# EAGLE design VideoAudio (EAGLE 8.0.0)
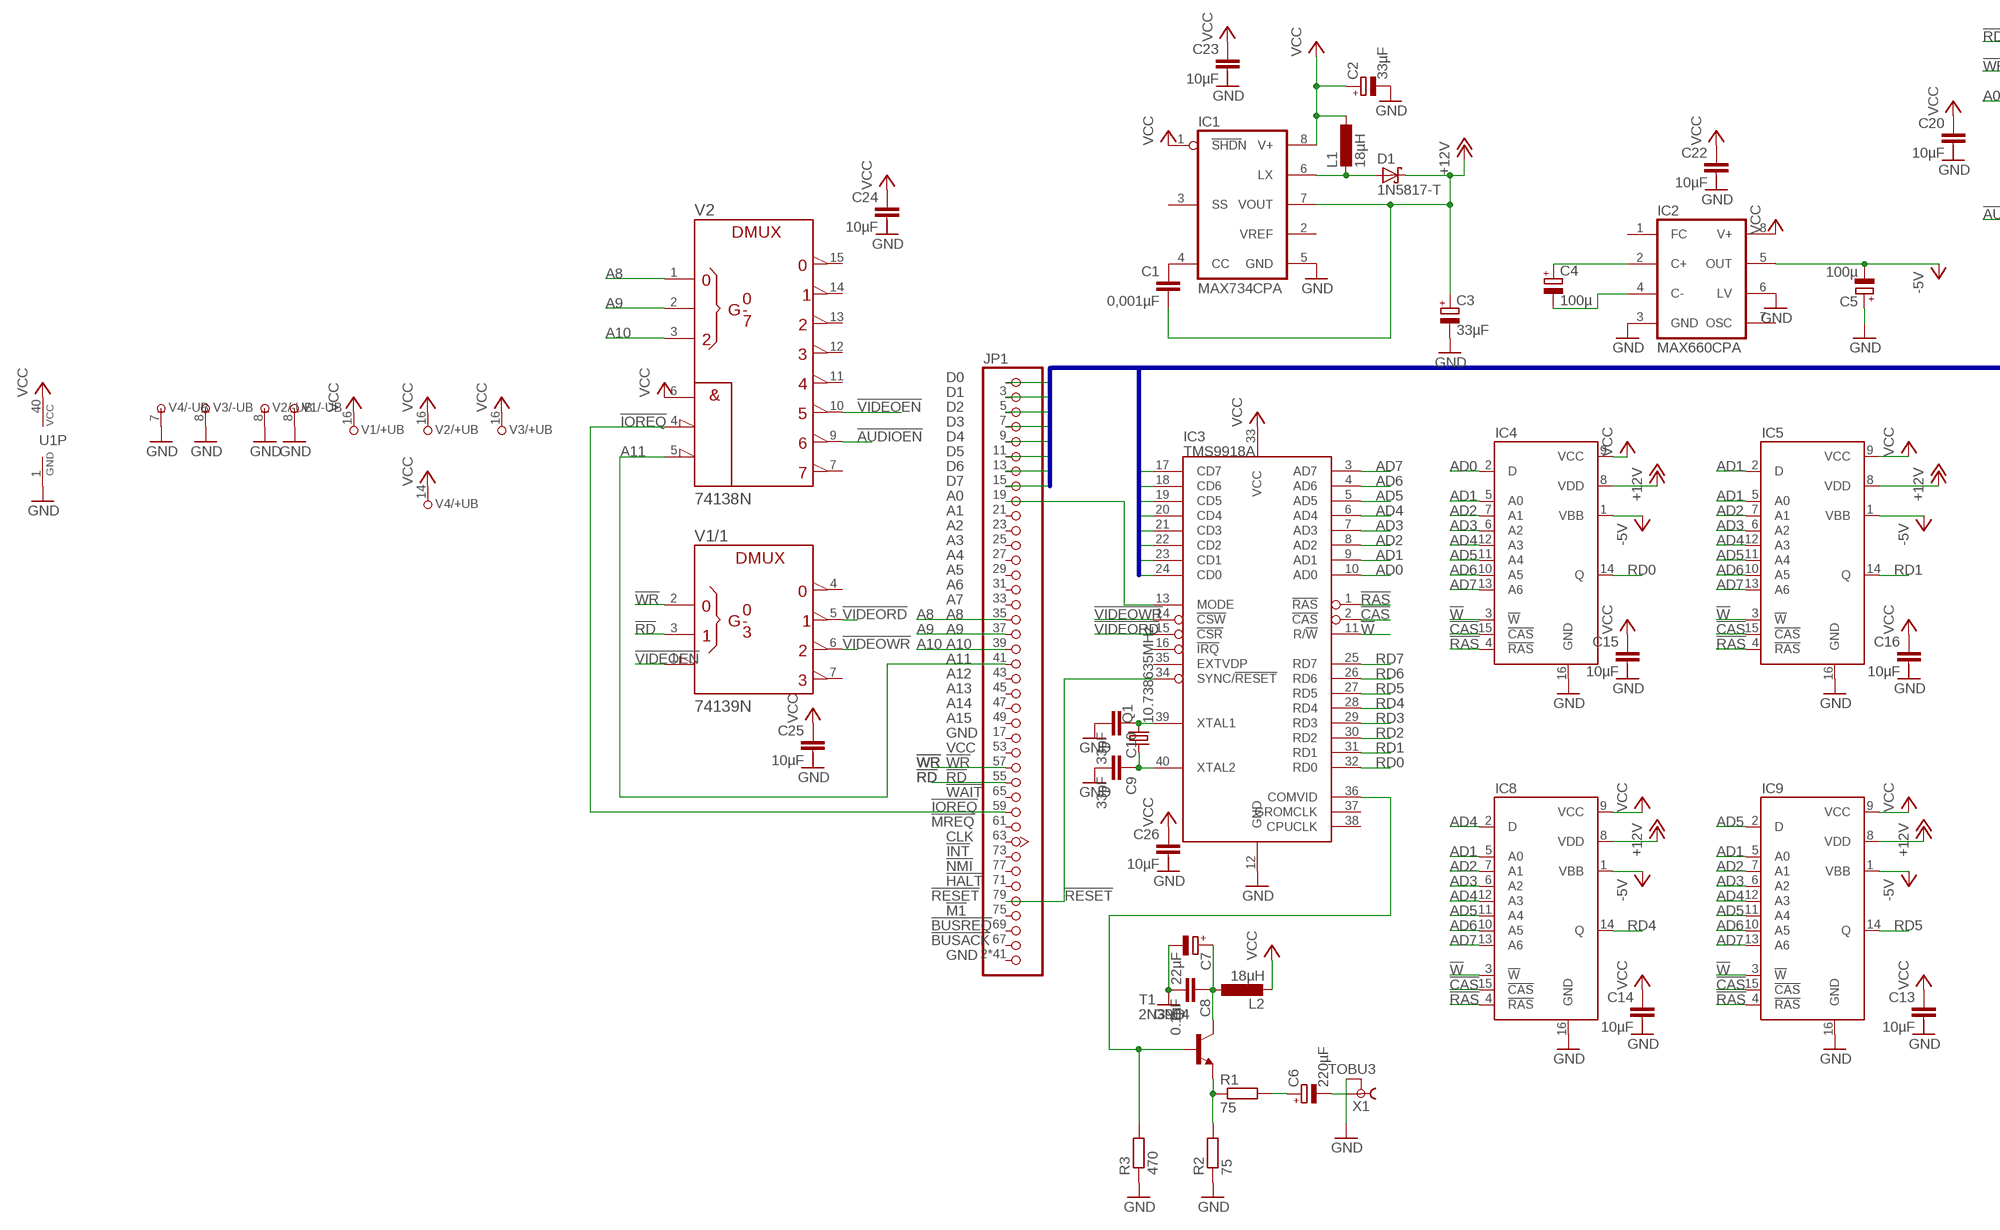
[diagram p0: schematic, sheet 1, part 1 of 2]
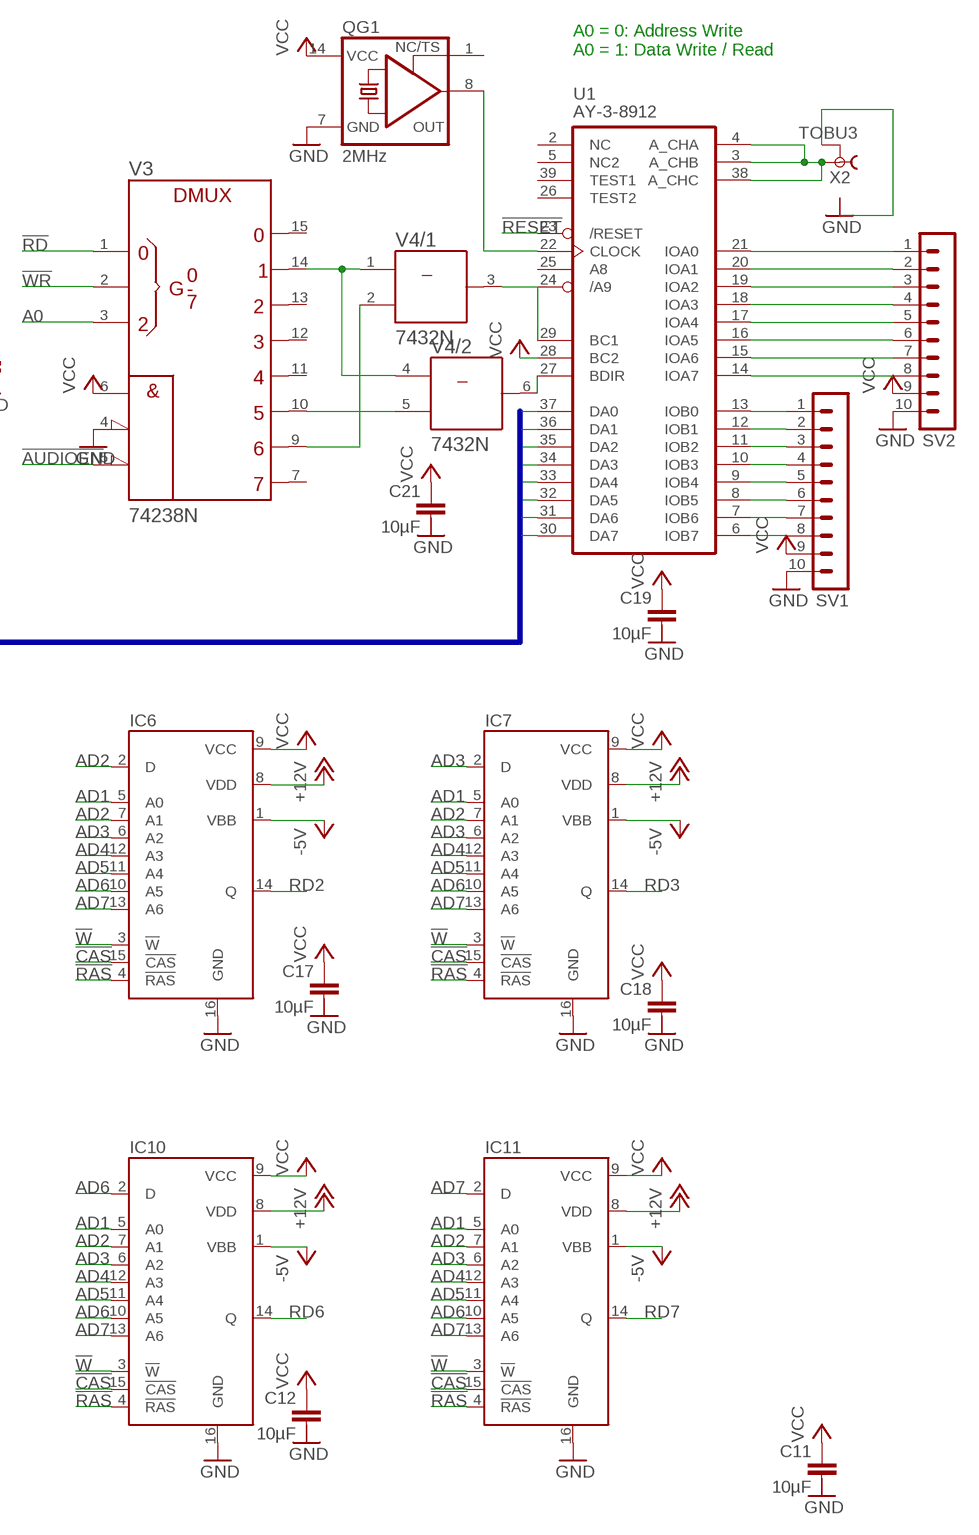
[diagram p1: schematic, sheet 1, part 2 of 2]

## Parts
C1  0,001µF  C-EU050-025X075  [C050-025X075]
C2  33µF  CPOL-EUE2.5-5  [E2,5-5]
C3  33µF  CPOL-EUE2.5-5  [E2,5-5]
C4  100µ  CPOL-EUE2.5-6  [E2,5-6]
C5  100µ  CPOL-EUE2.5-6  [E2,5-6]
C6  220µF  CPOL-EUE2.5-5  [E2,5-5]
C7  22µF  CPOL-EUE2.5-5  [E2,5-5]
C8  0.1µF  C-EU025-030X050  [C025-030X050]
C9  33pF  C-EU025-030X050  [C025-030X050]
C10  33pF  C-EU025-030X050  [C025-030X050]
C11  10µF  C-EU050-025X075  [C050-025X075]
C12  10µF  C-EU050-025X075  [C050-025X075]
C13  10µF  C-EU050-025X075  [C050-025X075]
C14  10µF  C-EU050-025X075  [C050-025X075]
C15  10µF  C-EU050-025X075  [C050-025X075]
C16  10µF  C-EU050-025X075  [C050-025X075]
C17  10µF  C-EU050-025X075  [C050-025X075]
C18  10µF  C-EU050-025X075  [C050-025X075]
C19  10µF  C-EU050-025X075  [C050-025X075]
C20  10µF  C-EU050-025X075  [C050-025X075]
C21  10µF  C-EU050-025X075  [C050-025X075]
C22  10µF  C-EU050-025X075  [C050-025X075]
C23  10µF  C-EU050-025X075  [C050-025X075]
C24  10µF  C-EU050-025X075  [C050-025X075]
C25  10µF  C-EU050-025X075  [C050-025X075]
C26  10µF  C-EU050-025X075  [C050-025X075]
D1  1N5817-T  [DO41-7.6]
IC1  MAX734CPA  [DIL08]
IC2  MAX660CPA  [DIL08]
IC3  TMS9918A  [DIP40]
IC4  TMS4116  [DIL16]
IC5  TMS4116  [DIL16]
IC6  TMS4116  [DIL16]
IC7  TMS4116  [DIL16]
IC8  TMS4116  [DIL16]
IC9  TMS4116  [DIL16]
IC10  TMS4116  [DIL16]
IC11  TMS4116  [DIL16]
JP1  JEANNECTOR/90  [2X25/90]
L1  18µH  L-EU0204/7  [0204/7]
L2  18µH  L-EU0204/7  [0204/7]
Q1  10.738635MHz  CRYSTALHC49U70  [HC49U70]
QG1  2MHz  XO-14  [DIL14S]
R1  75  R-EU_0204/2V  [0204V]
R2  75  R-EU_0204/2V  [0204V]
R3  470  R-EU_0204/2V  [0204V]
SV1  MA10-1  [MA10-1]
SV2  MA10-1  [MA10-1]
T1  2N3904  [TO92]
U1  AY-3-8912  [DIL40]
V1  74139N  [DIL16]
V2  74138N  [DIL16]
V3  74238N  [DIL16]
V4  7432N  [DIL14]
X1  TOBU3  [TOBU3]
X2  TOBU3  [TOBU3]

## Nets
!AUDIOEN: V2.9(Y6) V3.5(!G2B)
!CAS: IC3.2(!CAS) IC4.15(!CAS) IC5.15(!CAS) IC6.15(!CAS) IC7.15(!CAS) IC8.15(!CAS) IC9.15(!CAS) IC10.15(!CAS) IC11.15(!CAS)
!IOREQ: JP1.59(!IOREQ) V2.4(!G2A)
!RAS: IC3.1(!RAS) IC4.4(!RAS) IC5.4(!RAS) IC6.4(!RAS) IC7.4(!RAS) IC8.4(!RAS) IC9.4(!RAS) IC10.4(!RAS) IC11.4(!RAS)
!RD: JP1.55(!RD) V1.3(/1:B) V3.1(A)
!RESET: IC3.34(SYNC/!RESET) JP1.79(!RESET) U1.23(/RESET)
!VIDEOEN: V1.1(/1:!G) V2.10(Y5)
!VIDEORD: IC3.15(!CSR) V1.5(/1:Y1)
!VIDEOWR: IC3.14(!CSW) V1.6(/1:Y2)
!W: IC3.11(R/!W) IC4.3(!W) IC5.3(!W) IC6.3(!W) IC7.3(!W) IC8.3(!W) IC9.3(!W) IC10.3(!W) IC11.3(!W)
!WR: JP1.57(!WR) V1.2(/1:A) V3.2(B)
+12V: C1.2 C3.+ D1.C IC1.7(VOUT) IC4.8(VDD) IC5.8(VDD) IC6.8(VDD) IC7.8(VDD) IC8.8(VDD) IC9.8(VDD) IC10.8(VDD) IC11.8(VDD)
-5V: C5.- IC2.5(OUT) IC4.1(VBB) IC5.1(VBB) IC6.1(VBB) IC7.1(VBB) IC8.1(VBB) IC9.1(VBB) IC10.1(VBB) IC11.1(VBB)
A0: V3.3(C)
A8: JP1.35(A8) V2.1(A)
A9: JP1.37(A9) V2.2(B)
A10: JP1.39(A10) V2.3(C)
A11: JP1.41(A11) V2.5(!G2B)
AD0: IC3.10(AD0) IC4.2(D)
AD1: IC3.9(AD1) IC4.5(A0) IC5.2(D) IC5.5(A0) IC6.5(A0) IC7.5(A0) IC8.5(A0) IC9.5(A0) IC10.5(A0) IC11.5(A0)
AD2: IC3.8(AD2) IC4.7(A1) IC5.7(A1) IC6.2(D) IC6.7(A1) IC7.7(A1) IC8.7(A1) IC9.7(A1) IC10.7(A1) IC11.7(A1)
AD3: IC3.7(AD3) IC4.6(A2) IC5.6(A2) IC6.6(A2) IC7.2(D) IC7.6(A2) IC8.6(A2) IC9.6(A2) IC10.6(A2) IC11.6(A2)
AD4: IC3.6(AD4) IC4.12(A3) IC5.12(A3) IC6.12(A3) IC7.12(A3) IC8.2(D) IC8.12(A3) IC9.12(A3) IC10.12(A3) IC11.12(A3)
AD5: IC3.5(AD5) IC4.11(A4) IC5.11(A4) IC6.11(A4) IC7.11(A4) IC8.11(A4) IC9.2(D) IC9.11(A4) IC10.11(A4) IC11.11(A4)
AD6: IC3.4(AD6) IC4.10(A5) IC5.10(A5) IC6.10(A5) IC7.10(A5) IC8.10(A5) IC9.10(A5) IC10.2(D) IC10.10(A5) IC11.10(A5)
AD7: IC3.3(AD7) IC4.13(A6) IC5.13(A6) IC6.13(A6) IC7.13(A6) IC8.13(A6) IC9.13(A6) IC10.13(A6) IC11.2(D) IC11.13(A6)
D0: IC3.24(CD0) JP1.1(D0) U1.37(DA0)
D1: IC3.23(CD1) JP1.3(D1) U1.36(DA1)
D2: IC3.22(CD2) JP1.5(D2) U1.35(DA2)
D3: IC3.21(CD3) JP1.7(D3) U1.34(DA3)
D4: IC3.20(CD4) JP1.9(D4) U1.33(DA4)
D5: IC3.19(CD5) JP1.11(D5) U1.32(DA5)
D6: IC3.18(CD6) JP1.13(D6) U1.31(DA6)
D7: IC3.17(CD7) JP1.15(D7) U1.30(DA7)
GND: C2.- C3.- C5.+ C7.- C8.2 C9.2 C10.2 IC1.5(GND) IC2.3(GND) IC2.6(LV) IC3.12(GND) IC4.16(GND) IC5.16(GND) IC6.16(GND) IC7.16(GND) IC8.16(GND) IC9.16(GND) IC10.16(GND) IC11.16(GND) QG1.7(GND) R2.1 R3.1 SV1.10 SV2.10 U1.1(GND) V1.8(/-UB:-UB) V2.8(-UB) V3.4(!G2A) V3.8(-UB) V4.7(/-UB:-UB) X1.2 X1.2@1 X1.2@2 X2.2 X2.2@1 X2.2@2
N$1: C4.- IC2.4(C-)
N$2: C4.+ IC2.2(C+)
N$3: D1.A IC1.6(LX) L1.2
N$4: C1.1 IC1.4(CC)
N$5: IC3.13(MODE) JP1.19(A0)
N$6: U1.3(A_CHB) U1.4(A_CHA) U1.38(A_CHC) X2.1
N$7: C6.- X1.1
N$8: C6.+ R1.2
N$9: R1.1 R2.2 T1.3(E)
N$10: IC3.36(COMVID) R3.2 T1.2(B)
N$11: V3.9(Y6) V4.2(/1:B)
N$12: C7.+ C8.1 L2.1 T1.1(C)
N$13: C10.1 IC3.39(XTAL1) Q1.2
N$14: C9.1 IC3.40(XTAL2) Q1.1
N$15: U1.29(BC1) V4.3(/1:Y)
N$16: V3.14(Y1) V4.1(/1:A) V4.4(/2:A)
N$17: U1.27(BDIR) V4.6(/2:Y)
N$18: V3.10(Y5) V4.5(/2:B)
N$19: SV1.1 U1.13(IOB0)
N$20: SV1.2 U1.12(IOB1)
N$21: SV1.3 U1.11(IOB2)
N$22: SV1.4 U1.10(IOB3)
N$23: SV1.5 U1.9(IOB4)
N$24: SV1.6 U1.8(IOB5)
N$25: SV1.7 U1.7(IOB6)
N$26: SV1.8 U1.6(IOB7)
N$27: QG1.8(OUT) U1.22(CLOCK)
N$28: SV2.1 U1.21(IOA0)
N$29: SV2.2 U1.20(IOA1)
N$30: SV2.3 U1.19(IOA2)
N$31: SV2.4 U1.18(IOA3)
N$32: SV2.5 U1.17(IOA4)
N$33: SV2.6 U1.16(IOA5)
N$34: SV2.7 U1.15(IOA6)
N$35: SV2.8 U1.14(IOA7)
RD0: IC3.32(RD0) IC4.14(Q)
RD1: IC3.31(RD1) IC5.14(Q)
RD2: IC3.30(RD2) IC6.14(Q)
RD3: IC3.29(RD3) IC7.14(Q)
RD4: IC3.28(RD4) IC8.14(Q)
RD5: IC3.27(RD5) IC9.14(Q)
RD6: IC3.26(RD6) IC10.14(Q)
RD7: IC3.25(RD7) IC11.14(Q)
VCC: C2.+ C11.1 C12.1 C13.1 C14.1 C15.1 C16.1 C17.1 C18.1 C19.1 C20.1 C21.1 C22.1 C23.1 C24.1 C25.1 C26.1 IC1.1(SHDN) IC1.8(V+) IC2.8(V+) IC3.33(VCC) IC4.9(VCC) IC5.9(VCC) IC6.9(VCC) IC7.9(VCC) IC8.9(VCC) IC9.9(VCC) IC10.9(VCC) IC11.9(VCC) L1.1 L2.2 QG1.14(VCC) SV1.9 SV2.9 U1.28(BC2) U1.40(VCC) V1.16(/+UB:+UB) V2.6(G1) V2.16(+UB) V3.6(G1) V3.16(+UB) V4.14(/+UB:+UB)
Unconnected: C11.2 C12.2 C13.2 C14.2 C15.2 C16.2 C17.2 C18.2 C19.2 C20.2 C21.2 C22.2 C23.2 C24.2 C25.2 C26.2 IC1.2(VREF) IC1.3(SS) IC2.1(FC) IC2.7(OSC) IC3.16(!IRQ) IC3.35(EXTVDP) IC3.37(GROMCLK) IC3.38(CPUCLK) JP1.21(A1) JP1.23(A2) JP1.25(A3) JP1.27(A4) JP1.29(A5) JP1.31(A6) JP1.33(A7) JP1.43(A12) JP1.45(A13) JP1.47(A14) JP1.49(A15) JP1.61(!MREQ) JP1.63(CLK) JP1.65(!WAIT) JP1.67(!BUSACK) JP1.69(!BUSRQ) JP1.71(!HALT) JP1.73(!INT) JP1.75(!M1) JP1.77(!NMI) QG1.1(TS) U1.2(NC) U1.5(NC2) U1.24(/A9) U1.25(A8) U1.26(TEST2) U1.39(TEST1) V1.4(/1:Y0) V1.7(/1:Y3) V1.9(/2:Y3) V1.10(/2:Y2) V1.11(/2:Y1) V1.12(/2:Y0) V1.13(/2:B) V1.14(/2:A) V1.15(/2:!G) V2.7(Y7) V2.11(Y4) V2.12(Y3) V2.13(Y2) V2.14(Y1) V2.15(Y0) V3.7(Y7) V3.11(Y4) V3.12(Y3) V3.13(Y2) V3.15(Y0) V4.8(/3:Y) V4.9(/3:A) V4.10(/3:B) V4.11(/4:Y) V4.12(/4:A) V4.13(/4:B)

## Buses
D[0..7]

## Notes on the sheet
- A0 = 0: Address Write
  A0 = 1: Data Write / Read

## Power pins joined to a net without a drawn wire
GND: JP1.2(GND) JP1.4(GND) JP1.6(GND) JP1.8(GND) JP1.10(GND) JP1.12(GND) JP1.14(GND) JP1.16(GND) JP1.17(GND) JP1.18(GND) JP1.20(GND) JP1.22(GND) JP1.24(GND) JP1.26(GND) JP1.28(GND) JP1.30(GND) JP1.32(GND) JP1.34(GND) JP1.36(GND) JP1.38(GND) JP1.40(GND) JP1.42(GND) JP1.44(GND) JP1.46(GND) JP1.48(GND) JP1.50(GND) JP1.51(GND) JP1.52(GND) JP1.54(GND) JP1.56(GND) JP1.58(GND) JP1.60(GND) JP1.62(GND) JP1.64(GND) JP1.66(GND) JP1.68(GND) JP1.70(GND) JP1.72(GND) JP1.74(GND) JP1.76(GND) JP1.78(GND) JP1.80(GND)
VCC: JP1.53(VCC)

## Library data of the parts
C1 C8-C26 = rcl:C-EU: CAPACITOR, European symbol
C2-C7 = rcl:CPOL-EU: POLARIZED CAPACITOR, European symbol
D1 = diode:1N581*: 1.0A SCHOTTKY BARRIER RECTIFIER Source: http://www.diodes.com/datasheets/ds23001.pdf
IC1 = jean:MAX734CPA: DC/DC CONVERTER; OC_FARNELL: unknown; OC_NEWARK: unknown
IC2 = maxim:MAX660CPA: Charge-pump VOLTAGE CONVERTER; MF: MAXIM; MPN: MAX660CPA; OC_FARNELL: 1187928; OC_NEWARK: 34C3964
IC3 = jean:TMS9918A
IC4-IC11 = jean:TMS4116: Dual In Line / Socket
JP1 = jean:JEANNECTOR: PIN HEADER
L1 L2 = rcl:L-EU: INDUCTOR, European symbol
Q1 = crystal:CRYSTAL: CRYSTAL; OC_FARNELL: unknown; OC_NEWARK: unknown
QG1 = crystal:XO-: CRYSTAL; OC_FARNELL: unknown; OC_NEWARK: unknown
R1-R3 = resistor:R-EU_: RESISTOR, European symbol
SV1 SV2 = con-lstb:MA10-1: PIN HEADER; OC_FARNELL: unknown; OC_NEWARK: unknown
T1 = transistor:2N3904: NPN TRANSISTOR
U1 = oldchips:AY-3-8912: Programmable sound generator
V1 = 74ttl-din:74*139: Dual 2-line to 4-line DECODER/DEMULTIPLEXER
V2 = 74ttl-din:74*138: 3-line to 8-line DECODER/DEMULTIPLEXER
V3 = 74ttl-din:74*238: 1 of 8 noninverting DECODER/DEMULTIPLEXER
V4 = 74ttl-din:74*32: Quad 2-input OR gate
X1 X2 = con-hirschmann:TOBU3: Female Cinch CONNECTOR ( RCA Jack ); MF: FARNELL; MPN: TOBU 3; OC_FARNELL: 592791; OC_NEWARK: 06WX5914

## Board
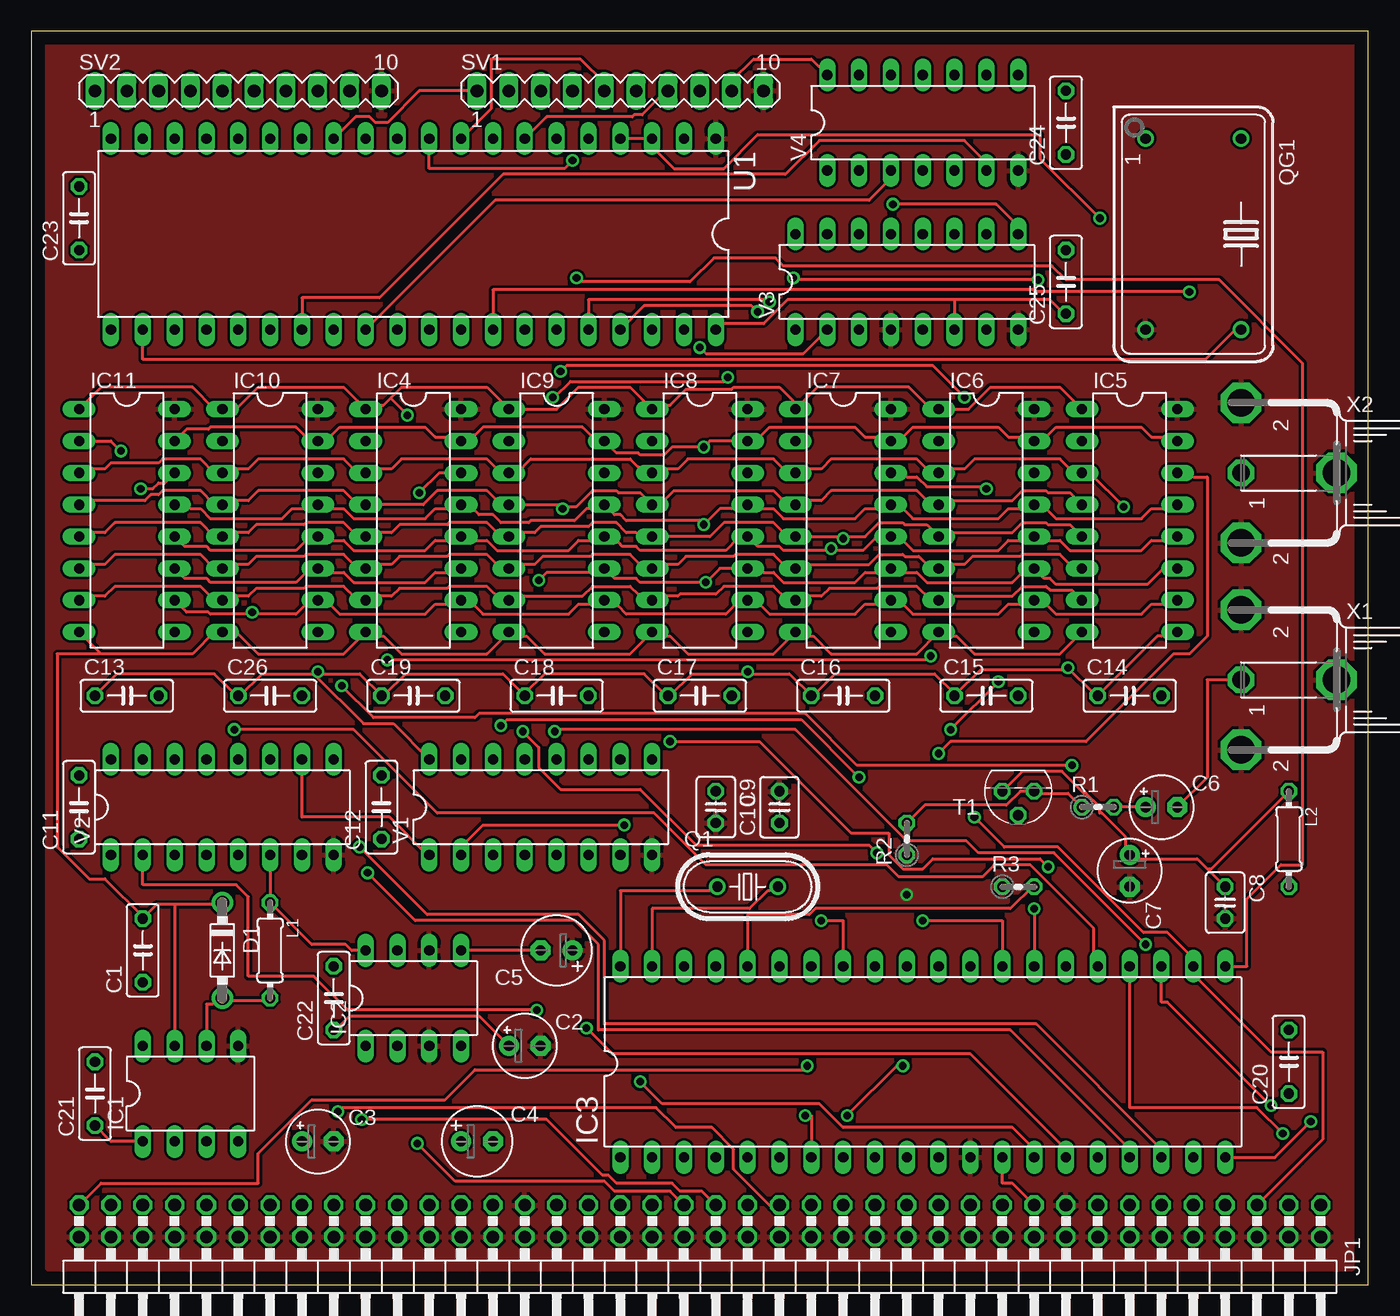
[diagram p2: board, top side]
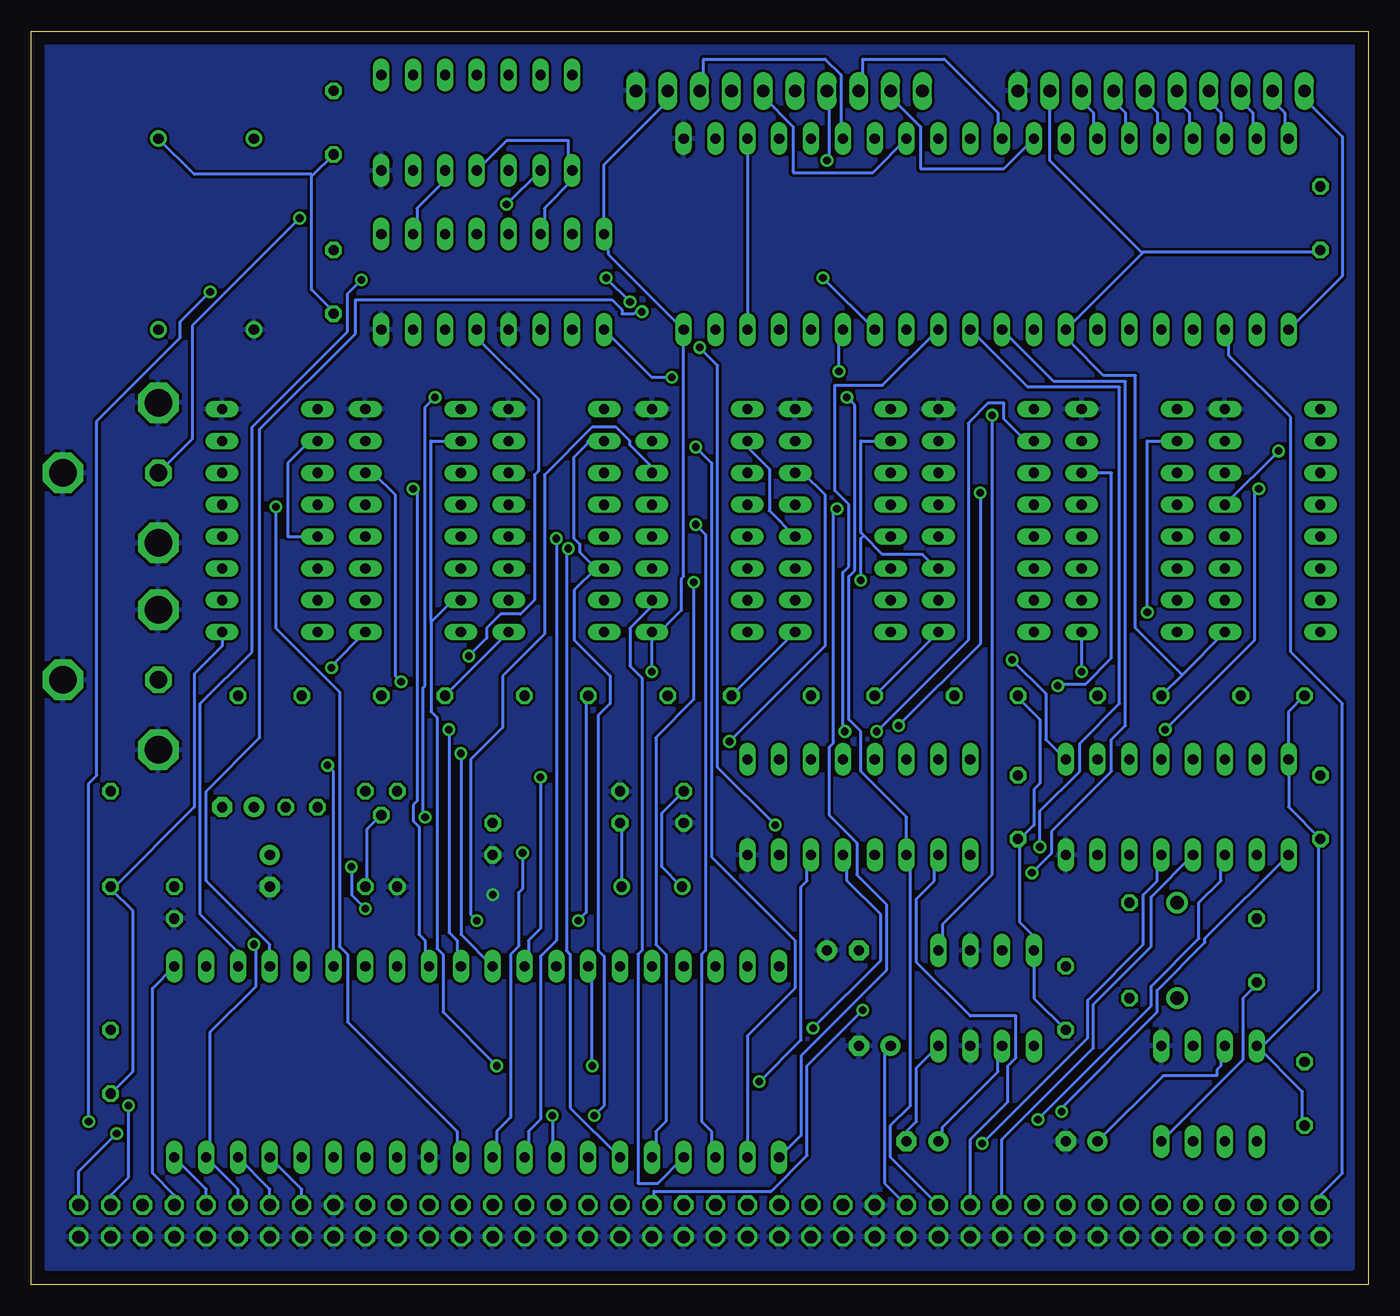
[diagram p3: board, bottom side, seen from below]

Size 106.66 x 100 mm. Coordinates in mm from the lower left corner, seen from the top.
Outline: 0,0 106.66,0 106.66,100 0,100 0,0
Copper layers (1*16): Top 0.035mm / dielectric 1.5mm / Bottom 0.035mm
Design rules "default": minimum track width 10mil, minimum drill 24mil, track to track 8mil, track to pad 8mil, pad to pad 8mil, via to via 8mil, smd to smd 8mil, copper to edge 40mil, drill to drill 8mil, minimum pad ring 10mil, minimum via ring 8mil, stop-mask expansion 4mil, vias tented up to drill 0mil, thermal gap 10mil

### Footprints (pad centres in the part's own frame; a part is rotated, then mirrored left to right if it is on the bottom)
C050-025X075 = drill 0.813 octagon: 1 -2.54,0; 2 2.54,0
E2,5-5 = drill 0.813 pad 1.6: + -1.27,0 | drill 0.813 pad 1.6 octagon: - 1.27,0
E2,5-6 = drill 0.813 pad 1.6: + -1.27,0 | drill 0.813 pad 1.6 octagon: - 1.27,0
C025-030X050 = drill 0.813 octagon: 1 -1.27,0; 2 1.27,0
DO41-7.6 = drill 1.1 pad 1.7: A 3.81,0; C -3.81,0
DIL08 = drill 0.813 long: 1 -3.81,-3.81; 2 -1.27,-3.81; 3 1.27,-3.81; 4 3.81,-3.81; 5 3.81,3.81; 6 1.27,3.81; 7 -1.27,3.81; 8 -3.81,3.81
DIP40 = drill 0.813 long: 1 -22.86,-7.62; 2 -20.32,-7.62; 3 -17.78,-7.62; 4 -15.24,-7.62; 5 -12.7,-7.62; 6 -10.16,-7.62; 7 -7.62,-7.62; 8 -5.08,-7.62; 9 -2.54,-7.62; 10 0,-7.62; 11 2.54,-7.62; 12 5.08,-7.62; 13 7.62,-7.62; 14 10.16,-7.62; 15 12.7,-7.62; 16 15.24,-7.62; 17 17.78,-7.62; 18 20.32,-7.62; 19 22.86,-7.62; 20 25.4,-7.62; 21 25.4,7.62; 22 22.86,7.62; 23 20.32,7.62; 24 17.78,7.62; 25 15.24,7.62; 26 12.7,7.62; 27 10.16,7.62; 28 7.62,7.62; 29 5.08,7.62; 30 2.54,7.62; 31 0,7.62; 32 -2.54,7.62; 33 -5.08,7.62; 34 -7.62,7.62; 35 -10.16,7.62; 36 -12.7,7.62; 37 -15.24,7.62; 38 -17.78,7.62; 39 -20.32,7.62; 40 -22.86,7.62
DIL16 = drill 0.813 long: 1 -8.89,-3.81; 2 -6.35,-3.81; 3 -3.81,-3.81; 4 -1.27,-3.81; 5 1.27,-3.81; 6 3.81,-3.81; 7 6.35,-3.81; 8 8.89,-3.81; 9 8.89,3.81; 10 6.35,3.81; 11 3.81,3.81; 12 1.27,3.81; 13 -1.27,3.81; 14 -3.81,3.81; 15 -6.35,3.81; 16 -8.89,3.81
2X25/90 = drill 1.016 octagon: 1 -29.21,-6.35; 2 -29.21,-3.81; 3 -26.67,-6.35; 4 -26.67,-3.81; 5 -24.13,-6.35; 6 -24.13,-3.81; 7 -21.59,-6.35; 8 -21.59,-3.81; 9 -19.05,-6.35; 10 -19.05,-3.81; 11 -16.51,-6.35; 12 -16.51,-3.81; 13 -13.97,-6.35; 14 -13.97,-3.81; 15 -11.43,-6.35; 16 -11.43,-3.81; 17 -8.89,-6.35; 18 -8.89,-3.81; 19 -6.35,-6.35; 20 -6.35,-3.81; 21 -3.81,-6.35; 22 -3.81,-3.81; 23 -1.27,-6.35; 24 -1.27,-3.81; 25 1.27,-6.35; 26 1.27,-3.81; 27 3.81,-6.35; 28 3.81,-3.81; 29 6.35,-6.35; 30 6.35,-3.81; 31 8.89,-6.35; 32 8.89,-3.81; 33 11.43,-6.35; 34 11.43,-3.81; 35 13.97,-6.35; 36 13.97,-3.81; 37 16.51,-6.35; 38 16.51,-3.81; 39 19.05,-6.35; 40 19.05,-3.81; 41 21.59,-6.35; 42 21.59,-3.81; 43 24.13,-6.35; 44 24.13,-3.81; 45 26.67,-6.35; 46 26.67,-3.81; 47 29.21,-6.35; 48 29.21,-3.81; 49 31.75,-6.35; 50 31.75,-3.81; 51 34.29,-6.35; 52 34.29,-3.81; 53 36.83,-6.35; 54 36.83,-3.81; 55 39.37,-6.35; 56 39.37,-3.81; 57 41.91,-6.35; 58 41.91,-3.81; 59 44.45,-6.35; 60 44.45,-3.81; 61 46.99,-6.35; 62 46.99,-3.81; 63 49.53,-6.35; 64 49.53,-3.81; 65 52.07,-6.35; 66 52.07,-3.81; 67 54.61,-6.35; 68 54.61,-3.81; 69 57.15,-6.35; 70 57.15,-3.81; 71 59.69,-6.35; 72 59.69,-3.81; 73 62.23,-6.35; 74 62.23,-3.81; 75 64.77,-6.35; 76 64.77,-3.81; 77 67.31,-6.35; 78 67.31,-3.81; 79 69.85,-6.35; 80 69.85,-3.81
0204/7 = drill 0.813 octagon: 1 -3.81,0; 2 3.81,0
HC49U70 = drill 0.813: 1 -2.413,0; 2 2.413,0
DIL14S = drill 0.813: 1 -7.62,-3.81; 7 7.62,-3.81; 8 7.62,3.81; 14 -7.62,3.81
0204V = drill 0.813 octagon: 1 -1.27,0; 2 1.27,0
MA10-1 = drill 1.016 long: 1 -11.43,0; 2 -8.89,0; 3 -6.35,0; 4 -3.81,0; 5 -1.27,0; 6 1.27,0; 7 3.81,0; 8 6.35,0; 9 8.89,0; 10 11.43,0
TO92 = drill 0.813 octagon: 1 1.27,0; 2 0,1.905; 3 -1.27,0
DIL40 = drill 0.813 long: 1 -24.13,-7.62; 2 -21.59,-7.62; 3 -19.05,-7.62; 4 -16.51,-7.62; 5 -13.97,-7.62; 6 -11.43,-7.62; 7 -8.89,-7.62; 8 -6.35,-7.62; 9 -3.81,-7.62; 10 -1.27,-7.62; 11 1.27,-7.62; 12 3.81,-7.62; 13 6.35,-7.62; 14 8.89,-7.62; 15 11.43,-7.62; 16 13.97,-7.62; 17 16.51,-7.62; 18 19.05,-7.62; 19 21.59,-7.62; 20 24.13,-7.62; 21 24.13,7.62; 22 21.59,7.62; 23 19.05,7.62; 24 16.51,7.62; 25 13.97,7.62; 26 11.43,7.62; 27 8.89,7.62; 28 6.35,7.62; 29 3.81,7.62; 30 1.27,7.62; 31 -1.27,7.62; 32 -3.81,7.62; 33 -6.35,7.62; 34 -8.89,7.62; 35 -11.43,7.62; 36 -13.97,7.62; 37 -16.51,7.62; 38 -19.05,7.62; 39 -21.59,7.62; 40 -24.13,7.62
DIL14 = drill 0.813 long: 1 -7.62,-3.81; 2 -5.08,-3.81; 3 -2.54,-3.81; 4 0,-3.81; 5 2.54,-3.81; 6 5.08,-3.81; 7 7.62,-3.81; 8 7.62,3.81; 9 5.08,3.81; 10 2.54,3.81; 11 0,3.81; 12 -2.54,3.81; 13 -5.08,3.81; 14 -7.62,3.81
TOBU3 = drill 1.397 octagon: 1 0,-2.54 | drill 2.21 octagon: 2 5.588,-2.54; 2@1 -5.588,-2.54; 2@2 0,5.08

### Placement (x,y rotation side)
C1  8.89,26.67 90 top
C2  39.37,19.05 0 top
C3  22.86,11.43 0 top
C4  35.56,11.43 0 top
C5  41.91,26.67 180 top
C6  90.17,38.1 0 top
C7  87.63,33.02 270 top
C8  95.25,30.48 270 top
C9  54.61,38.1 270 top
C10  59.69,38.1 90 top
C11  3.81,38.1 90 top
C12  27.94,38.1 90 top
C13  7.62,46.99 0 top
C14  87.63,46.99 0 top
C15  76.2,46.99 0 top
C16  64.77,46.99 0 top
C17  53.34,46.99 0 top
C18  41.91,46.99 0 top
C19  30.48,46.99 0 top
C20  100.33,17.78 90 top
C21  5.08,15.24 90 top
C22  24.13,22.86 90 top
C23  3.81,85.09 90 top
C24  82.55,92.71 90 top
C25  82.55,80.01 90 top
C26  19.05,46.99 0 top
D1  15.24,26.67 270 top
IC1  12.7,15.24 0 top
IC2  30.48,22.86 0 top
IC3  69.85,17.78 0 top
IC4  30.48,60.96 270 top
IC5  87.63,60.96 270 top
IC6  76.2,60.96 270 top
IC7  64.77,60.96 270 top
IC8  53.34,60.96 270 top
IC9  41.91,60.96 270 top
IC10  19.05,60.96 270 top
IC11  7.62,60.96 270 top
JP1  73.66,0 180 top
L1  19.05,26.67 270 top
L2  100.33,35.56 270 top
Q1  57.15,31.75 0 top
QG1  92.71,83.82 270 top
R1  85.09,38.1 0 top
R2  69.85,35.56 90 top
R3  78.74,31.75 0 top
SV1  46.99,95.25 0 top
SV2  16.51,95.25 0 top
T1  78.74,39.37 180 top
U1  30.48,83.82 180 top
V1  40.64,38.1 0 top
V2  15.24,38.1 0 top
V3  69.85,80.01 0 top
V4  71.12,92.71 0 top
X1  99.06,48.26 270 top
X2  99.06,64.77 270 top

### Tracks (layer width: path | path; a pad name or v marks a point on that pad's centre or on a via)
!AUDIOEN  (via drill 0.61)
  Top 0.254: v28.42,49.85 71.44,49.85 v71.75,50.16
  Bottom 0.254: V2.9 25.72,43.5 25.72,47.15 v28.42,49.85 | v71.75,50.16 70.33,51.59 70.33,52.39 69.21,53.5 67.63,53.5 66.52,54.61 66.52,64.61 66.2,64.93 66.2,70.64 71.12,75.56 V3.5
!CAS  (via drill 0.61)
  Top 0.254: IC11.15 12.38,68.26 14.13,68.26 14.29,68.42 21.11,68.42 22.22,67.31 IC10.15 23.5,67.31 24.61,68.42 31.43,68.42 32.23,67.63 33.97,67.63 IC4.15 34.29,67.47 34.61,67.79 35.4,67.79 36.04,68.42 43.97,68.42 45.09,67.31 IC9.15 46.67,66.36 48.42,66.36 48.58,66.2 50.48,66.2 51.12,66.83 v53.66,66.83 54.13,67.31 IC8.15 57.79,67.31 58.9,68.42 65.72,68.42 66.52,67.63 68.26,67.63 IC7.15 68.58,67.47 69.37,67.47 70.33,68.42 77.15,68.42 77.95,67.63 79.69,67.63 IC6.15 80.01,67.47 80.8,67.47 81.76,68.42 88.58,68.42 89.38,67.63 91.12,67.63 IC5.15
  Bottom 0.254: IC3.2 49.53,19.84 45.72,23.65 45.72,27.46 52.39,34.13 52.39,65.56 v53.66,66.83
!IOREQ
  Bottom 0.254: V2.4 17.3,30.96 17.3,26.99 21.91,22.38 21.91,18.89 29.21,11.59 JP1.59
!RAS  (via drill 0.61)
  Top 0.254: IC5.4 82.87,63.18 81.12,63.18 80.96,63.34 79.06,63.34 78.26,62.55 71.6,62.55 IC6.4 71.75,62.23 70.64,63.34 63.82,63.34 63.02,62.55 61.28,62.55 IC7.4 60.96,62.39 60.64,62.71 59.85,62.71 59.21,63.34 51.28,63.34 50.32,62.39 49.53,62.39 IC8.4 48.58,63.18 46.83,63.18 46.67,63.34 44.77,63.34 43.5,62.07 42.39,62.07 v42.39,61.91 42.07,62.23 IC9.4 37.47,62.23 36.35,63.34 32.38,63.34 31.27,62.23 IC4.4 26.04,62.23 24.92,63.34 18.1,63.34 17.3,62.55 15.56,62.55 IC10.4 14.61,62.23 13.49,63.34 10.48,63.34 10.16,63.02 9.53,63.02 9.05,62.55 4.13,62.55 IC11.4
  Bottom 0.254: IC3.1 45.24,11.91 45.24,18.26 38.42,25.08 38.42,30.32 40.8,32.7 40.8,35.24 43.02,37.47 43.02,42.86 42.7,43.18 42.7,61.59 v42.39,61.91
!RD  (via drill 0.61)
  Top 0.254: v55.56,72.39 55.25,72.07 43.02,72.07 41.75,70.8 v41.59,70.8
  Bottom 0.254: JP1.55 38.1,10.16 38.1,12.7 36.51,14.29 36.51,33.97 V1.3 36.83,37.31 40.48,40.96 40.48,44.13 41.43,45.09 41.43,56.52 40.96,56.99 40.96,70.17 v41.59,70.8 | V3.1 57.15,72.39 v55.56,72.39
!RESET  (via drill 0.61)
  Top 0.254: v61.91,17.46 61.6,17.14 35.4,17.14 33.02,14.76 22.38,14.76 18.1,10.48 18.1,8.1 5.56,8.1 JP1.79
  Bottom 0.254: IC3.34 61.91,25.08 v61.91,17.46 | U1.23 11.11,75.88 11.11,74.14 6.19,69.22 6.19,50.48 2.06,46.35 2.06,8.89 3.81,7.14 JP1.79
!VIDEOEN
  Top 0.254: V2.10 21.59,37.31 28.57,37.31 31.59,34.29 V1.1
!VIDEORD  (via drill 0.61)
  Top 0.254: v44.29,20.48 46.36,18.41 74.93,18.41 82.55,10.79 IC3.15
  Bottom 0.254: V1.5 41.59,33.97 41.59,32.23 38.89,29.53 38.89,25.88 v44.29,20.48
!VIDEOWR  (via drill 0.61)
  Top 0.254: v48.58,16.19 50.32,14.45 62.87,14.45 64.77,12.54 78.26,12.54 80.01,10.79 IC3.14
  Bottom 0.254: V1.6 44.77,33.97 44.77,32.23 45.24,31.75 45.24,19.53 v48.58,16.19
!W  (via drill 0.61)
  Top 0.254: IC11.3 4.13,65.09 5.87,65.09 6.35,65.56 10.16,65.56 10.48,65.88 13.49,65.88 14.61,64.77 IC10.3 15.56,65.09 17.3,65.09 18.1,65.88 24.92,65.88 25.88,64.93 26.67,64.93 IC4.3 26.99,65.09 28.73,65.09 29.53,65.88 36.35,65.88 37.47,64.77 IC9.3 38.74,64.77 39.85,65.88 47.78,65.88 48.42,65.25 49.21,65.25 49.53,64.93 IC8.3 49.85,65.09 51.59,65.09 52.39,65.88 59.21,65.88 60.33,64.77 IC7.3 61.28,65.09 63.02,65.09 63.82,65.88 70.64,65.88 71.6,64.93 72.39,64.93 IC6.3 72.71,65.09 74.45,65.09 75.25,65.88 82.07,65.88 83.19,64.77 IC5.3 84.45,64.77 v87.15,62.07
  Bottom 0.254: IC3.11 72.71,10.48 72.71,12.22 81.44,20.95 81.44,26.35 82.07,26.99 82.07,47.31 87.15,52.39 v87.15,62.07
!WR  (via drill 0.61)
  Top 0.254: V3.2 61.6,74.3 53.82,74.3 v53.34,74.77 | v47.31,36.67 36.04,36.67 34.29,34.92 V1.2
  Bottom 0.254: V1.2 34.61,33.97 34.61,32.23 36.04,30.8 36.04,25.72 31.75,21.43 28.1,21.43 28.1,18.1 28.73,17.46 28.73,14.61 31.75,11.59 JP1.57 | v53.34,74.77 51.91,73.34 51.91,41.27 v47.31,36.67
+12V
  Top 0.254: 11.43,30.32 15.08,30.32 D1.C | 11.43,30.32 10,30.32 C1.2 8.89,29.37 5.87,32.38 4.6,32.38 2.06,34.92 2.06,50.32 5.4,50.32 5.48,50.4 | 11.43,30.32 IC1.7 | 5.48,50.4 5.56,50.32 12.86,50.32 14.61,52.07 IC10.8 16.35,52.07 18.1,50.32 24.92,50.32 IC4.8 26.51,51.75 28.1,51.75 29.53,50.32 36.35,50.32 IC9.8 37.94,51.75 39.53,51.75 40.96,50.32 47.78,50.32 IC8.8 49.37,51.75 50.96,51.75 52.39,50.32 59.21,50.32 IC7.8 60.8,51.75 62.39,51.75 63.82,50.32 70.64,50.32 IC6.8 72.23,51.75 73.82,51.75 75.25,50.32 82.07,50.32 IC5.8 | 5.48,50.4 IC11.8
  Bottom 0.254: C3.+ 16.35,16.67 12.06,16.67 12.06,17.14 11.75,17.46 11.75,17.78 11.43,18.1 IC1.7
-5V  (via drill 0.61)
  Top 0.254: IC5.1 82.07,71.6 76.52,71.6 74.77,69.85 IC6.1 71.75,69.85 70.01,71.6 62.71,71.6 IC7.1 61.12,70.17 59.69,71.6 56.04,71.6 55.88,71.44 52.23,71.44 50.96,70.17 49.37,70.17 IC8.1 47.78,71.6 43.66,71.6 41.91,69.85 IC9.1 36.35,71.6 29.53,71.6 28.65,70.72 | C5.- IC2.5 | IC11.1 5.56,71.6 12.86,71.6 14.61,69.85 IC10.1 16.35,69.85 18.1,71.6 24.92,71.6 IC4.1 26.51,70.17 28.1,70.17 28.65,70.72 | 28.65,70.72 v30,69.37
  Bottom 0.254: IC2.5 33.97,26.99 33.97,28.73 30,32.7 v30,69.37
A8  (via drill 0.61)
  Top 0.254: v24.45,13.81 24.77,14.13 49.85,14.13 51.44,12.54 54.29,12.54 56.04,10.79 56.04,9.21 59.05,6.19 59.53,6.19 JP1.35
  Bottom 0.254: V2.1 13.02,27.62 13.02,27.3 16.83,23.5 16.83,21.75 24.45,14.13 v24.45,13.81
A9  (via drill 0.61)
  Top 0.254: V2.2 8.89,31.91 16.35,31.91 17.3,30.96 17.3,24.61 22.54,24.61 25.24,21.91 v40.32,21.91
  Bottom 0.254: v40.32,21.91 44.77,17.46 44.77,10.32 47.62,7.46 56.99,7.46 56.99,6.51 JP1.37
A10  (via drill 0.61)
  Top 0.254: v26.35,13.18 41.12,13.18 45.56,8.73 46.04,8.73 46.67,8.1 51.12,8.1 51.75,7.46 53.5,7.46 JP1.39
  Bottom 0.254: V2.3 11.75,33.97 11.75,32.23 13.49,30.48 13.49,27.62 17.3,23.81 17.3,22.23 v26.35,13.18
A11  (via drill 0.61)
  Top 0.254: v30.8,11.27 33.81,8.26 45.72,8.26 46.51,7.46 50.96,7.46 JP1.41
  Bottom 0.254: V2.5 16.83,33.97 16.83,32.23 17.94,31.11 17.94,27.15 22.38,22.7 22.38,19.68 v30.8,11.27
AD0  (via drill 0.61)
  Top 0.254: v67.47,34.45 66.83,35.08 53.02,35.08 48.58,39.53 42.23,39.53 40.48,41.27 40.48,42.86 v39.21,44.13
  Bottom 0.254: IC3.10 69.53,10.48 69.53,12.22 68.42,13.34 68.42,26.35 67.79,26.99 67.79,31.27 67.47,31.59 v67.47,34.45 | v39.21,44.13 31.91,51.44 31.91,68.74 30.32,70.33 29.05,70.33 29.05,69.06 27.3,67.31 IC4.2
AD1  (via drill 0.61)
  Top 0.254: IC11.5 4.13,60.01 5.87,60.01 6.67,60.8 13.49,60.8 14.61,59.69 IC10.5 15.56,60.01 17.3,60.01 17.94,60.64 21.75,60.64 21.91,60.8 24.92,60.8 25.88,59.85 26.67,59.85 IC4.5 26.99,60.01 28.73,60.01 29.37,60.64 33.18,60.64 33.34,60.8 36.35,60.8 37.47,59.69 IC9.5 38.42,60.01 40.16,60.01 40.64,60.48 44.45,60.48 44.77,60.8 46.67,60.8 47.47,60.01 48.26,60.01 48.58,59.69 IC8.5 54.13,59.69 55.25,60.8 59.21,60.8 60.33,59.69 IC7.5 64.61,59.69 v64.77,59.53 64.77,59.69 66.52,59.69 67.63,60.8 69.53,60.8 69.69,60.64 71.44,60.64 IC6.5 72.23,60.01 78.26,60.01 79.06,60.8 80.96,60.8 81.12,60.64 82.87,60.64 IC5.5
  Bottom 0.254: IC5.5 86.2,59.69 86.2,65.56 84.45,67.31 IC5.2 | IC3.9 66.99,10.48 66.99,12.22 66.04,13.18 66.04,26.19 64.77,27.46 v64.77,59.53
AD2  (via drill 0.61)
  Top 0.254: IC11.7 4.13,54.93 5.87,54.93 6.67,55.72 13.49,55.72 14.61,54.61 IC10.7 15.56,54.93 17.3,54.93 17.94,55.56 21.75,55.56 21.91,55.72 24.92,55.72 25.88,54.77 26.67,54.77 IC4.7 26.99,54.93 28.73,54.93 29.37,55.56 33.18,55.56 33.34,55.72 36.35,55.72 37.47,54.61 IC9.7 37.31,54.93 43.97,54.93 44.77,55.72 47.78,55.72 48.42,55.09 49.21,55.09 49.53,54.77 IC8.7 49.85,54.93 51.59,54.93 51.75,55.09 54.61,55.09 55.25,55.72 59.21,55.72 60.33,54.61 IC7.7 61.28,54.93 63.02,54.93 63.66,55.56 67.47,55.56 67.63,55.72 70.64,55.72 71.75,54.61 IC6.7 73.34,54.61 73.66,54.93 78.26,54.93 79.06,55.72 80.96,55.72 81.28,55.4 83.03,55.4 IC5.7 | v65.09,13.49 69.06,17.46 v69.53,17.46
  Bottom 0.254: IC3.8 65.09,10.48 v65.09,13.49 | v69.53,17.46 73.82,21.75 73.82,26.35 74.3,26.83 74.3,45.24 74.77,45.72 74.77,52.86 74.69,52.94 | 74.69,52.94 73.02,54.61 IC6.7 | IC6.2 74.77,67.31 74.77,53.02 74.69,52.94
AD3  (via drill 0.61)
  Top 0.254: IC11.6 4.13,57.47 5.87,57.47 6.67,58.26 13.49,58.26 14.61,57.15 IC10.6 15.56,57.47 17.3,57.47 17.94,58.1 21.75,58.1 21.91,58.26 24.92,58.26 25.88,57.31 26.67,57.31 IC4.6 26.99,57.47 28.73,57.47 29.37,58.1 33.18,58.1 33.34,58.26 36.35,58.26 37.47,57.15 IC9.6 38.42,57.47 40.16,57.47 40.8,58.1 44.61,58.1 44.77,58.26 47.78,58.26 48.74,57.31 49.53,57.31 IC8.6 49.85,57.47 51.59,57.47 52.23,58.1 56.04,58.1 56.2,58.26 59.21,58.26 60.33,57.15 IC7.6 60.17,57.47 66.83,57.47 67.63,58.26 69.53,58.26 69.69,58.1 70.8,58.1 71.28,57.63 72.07,57.63 72.39,57.31 IC6.6 72.71,57.47 74.45,57.47 75.09,58.1 78.9,58.1 79.06,58.26 82.07,58.26 83.19,57.15 IC5.6 | IC3.7 62.23,13.49 v61.75,13.49
  Bottom 0.254: v61.75,13.49 60.96,14.29 60.96,26.19 61.44,26.67 61.44,45.4 60.48,46.35 60.48,48.58 63.34,51.44 63.34,55.4 61.6,57.15 IC7.6 61.75,57.15 61.75,57.31 62.87,58.42 62.87,59.05 63.34,59.53 63.34,66.04 62.23,67.15 62.23,67.31 IC7.2
AD4  (via drill 0.61)
  Top 0.254: IC11.12 12.22,58.9 13.97,58.9 14.29,58.58 21.11,58.58 22.22,59.69 IC10.12 22.07,59.37 24.92,59.37 25.72,58.58 31.43,58.58 32.23,59.37 33.97,59.37 IC4.12 34.13,59.37 36.35,59.37 37.15,58.58 42.86,58.58 43.66,59.37 45.4,59.37 IC9.12 45.72,59.53 46.04,59.21 46.83,59.21 47.15,58.9 48.26,58.9 48.58,58.58 55.4,58.58 56.36,59.53 57.15,59.53 IC8.12 57.94,58.9 59.69,58.9 60.01,58.58 63.82,58.58 | 63.82,58.58 66.36,58.58 67.47,59.69 IC7.12 69.21,59.69 70.33,58.58 77.15,58.58 77.95,59.37 79.69,59.37 IC6.12 79.85,59.37 82.07,59.37 82.87,58.58 88.58,58.58 89.38,59.37 91.12,59.37 IC5.12 | 63.82,58.58 v63.82,58.74
  Bottom 0.254: IC9.12 47.78,61.75 47.78,65.09 49.53,66.83 IC8.2 | IC3.6 63.66,14.13 63.66,26.35 63.98,26.67 63.98,58.58 v63.82,58.74
AD5  (via drill 0.61)
  Top 0.254: IC11.11 12.22,56.36 13.97,56.36 14.29,56.04 21.11,56.04 22.22,57.15 IC10.11 22.07,56.83 24.92,56.83 25.72,56.04 31.43,56.04 32.23,56.83 33.97,56.83 IC4.11 | IC5.11 90.33,57.15 89.06,55.88 81.76,55.88 81.28,56.36 80.8,56.36 IC6.11 80.01,56.99 79.69,56.67 78.9,56.67 78.26,56.04 71.44,56.04 70.64,56.83 68.42,56.83 IC7.11 68.26,56.83 66.52,56.83 65.72,56.04 60.01,56.04 59.21,56.83 58.42,56.83 58.1,57.15 IC8.11 54.93,57.15 v53.82,56.04 48.58,56.04 48.26,56.36 46.51,56.36 IC9.11 45.88,56.83 41.12,56.83 v40.48,56.2
  Bottom 0.254: IC9.2 40.48,67.31 40.48,60.01 40.24,59.77 | 40.24,59.77 38.74,58.26 35.56,58.26 34.45,57.15 IC4.11 | IC3.5 56.83,10.48 56.83,12.22 56.04,13.02 56.04,26.35 56.83,27.15 56.83,43.66 53.82,46.67 v53.82,56.04 | 40.24,59.77 40.48,59.53 v40.48,56.2
AD6  (via drill 0.61)
  Top 0.254: IC11.10 12.38,53.66 14.13,53.66 14.29,53.5 17.62,53.5 | 17.62,53.5 21.11,53.5 22.22,54.61 IC10.10 23.5,54.61 24.61,53.5 31.43,53.5 32.23,54.29 33.97,54.29 IC4.10 34.29,54.45 35.08,54.45 36.04,53.5 42.86,53.5 43.66,54.29 45.4,54.29 IC9.10 45.72,54.45 46.04,54.13 46.83,54.13 47.47,53.5 55.4,53.5 56.52,54.61 IC8.10 57.79,54.61 58.9,53.5 65.72,53.5 66.52,54.29 68.26,54.29 IC7.10 68.58,54.45 69.37,54.45 70.33,53.5 77.15,53.5 77.95,54.29 79.69,54.29 IC6.10 80.01,54.45 80.8,54.45 81.76,53.5 88.58,53.5 89.38,54.29 91.12,54.29 IC5.10 | 17.62,53.5 v17.62,53.66
  Bottom 0.254: IC10.2 17.62,67.31 v17.62,53.66 | IC3.4 56.67,8.1 58.26,8.1 58.26,26.35 57.94,26.67 57.94,48.42 58.9,49.37 58.9,52.39 57.15,54.13 IC8.10
AD7  (via drill 0.61)
  Top 0.254: v7.14,66.52 6.35,67.31 IC11.2 | IC11.13 12.38,62.23 12.7,61.91 13.49,61.91 14.29,61.12 20,61.12 20.8,61.91 22.54,61.91 IC10.13 22.7,61.91 24.92,61.91 25.72,61.12 31.43,61.12 32.23,61.91 33.97,61.91 IC4.13 34.29,62.07 34.61,61.75 35.4,61.75 35.72,61.44 36.83,61.44 37.47,60.8 39.69,60.8 39.85,60.96 43.34,60.96 44.29,61.91 45.88,61.91 IC9.13 46.51,61.44 46.99,61.44 47.47,60.96 53.82,60.96 v53.66,60.64 54.93,61.91 55.88,61.91 56.2,62.23 IC8.13 56.04,61.91 59.21,61.91 60.01,61.12 65.72,61.12 66.52,61.91 68.26,61.91 IC7.13 68.58,62.07 69.37,62.07 70.33,61.12 77.15,61.12 77.95,61.91 79.69,61.91 IC6.13 80.01,62.07 80.8,62.07 81.76,61.12 88.58,61.12 89.38,61.91 91.12,61.91 IC5.13
  Bottom 0.254: v7.14,66.52 IC11.13 | IC3.3 52.39,10.48 52.39,12.22 53.18,13.02 53.18,26.35 52.86,26.67 52.86,59.85 v53.66,60.64
D0  (via drill 0.61)
  Top 0.254: IC3.24 87.63,14.13 97.79,14.13 v99.85,12.06 | U1.37 48.9,78.11 57.47,78.11 v57.94,77.63
  Bottom 0.254: v99.85,12.06 102.87,9.05 JP1.1 | v57.94,77.63 58.42,77.63 58.58,77.47 59.53,77.47 59.53,77.79 60.33,78.58 80.8,78.58 80.8,75.88 88.42,68.26 88.42,43.66 92.71,39.37 92.71,32.23 87.63,27.15 IC3.24
D1  (via drill 0.61)
  Top 0.254: IC3.23 90.17,22.54 90.65,22.54 v98.9,14.29 | U1.36 44.45,78.58 58.74,78.58 v58.9,78.42 | v60.8,80.33 60.96,80.17 v80.33,80.17
  Bottom 0.254: v98.9,14.29 98.9,8.57 100.33,7.14 JP1.3 | v60.8,80.33 v58.9,78.42 | v80.33,80.17 81.44,79.06 81.44,76.04 89.06,68.42 89.06,50.48 93.19,46.35 93.19,29.53 90.17,26.51 IC3.23
D2  (via drill 0.61)
  Top 0.254: v42.23,72.87 42.7,73.34 71.91,73.34 v74.45,70.8 | v75.25,37.31 77.63,34.92 81.91,34.92 88.74,28.1 90.65,28.1 92.71,26.04 IC3.22 92.71,24.77 98.9,18.57 103.03,18.57 103.03,11.59 JP1.5
  Bottom 0.254: U1.35 42.23,75.88 v42.23,72.87 | v74.45,70.8 75.25,70.01 75.25,47.78 75.41,47.62 75.41,37.47 v75.25,37.31
D3  (via drill 0.61)
  Top 0.254: v43.5,80.33 43.82,80.01 52.55,80.01 54.45,81.92 59.37,81.92 60.01,81.28 81.44,81.28 82.55,80.17 94.77,80.17 101.44,73.5 101.44,33.5 99.69,33.5 97,30.8 97,25.4 IC3.21
  Bottom 0.254: IC3.21 97,23.65 97,8.89 95.25,7.14 JP1.7 | v43.5,80.33 U1.34
D4  (via drill 0.61)
  Top 0.254: U1.33 36.83,79.38 80.01,79.38 80.17,79.22 v92.39,79.22 | v102.08,13.02 99.22,10.16 IC3.20
  Bottom 0.254: IC3.20 92.71,7.62 JP1.9 | v92.39,79.22 94.77,76.83 94.77,75.56 101.44,68.9 101.44,40.64 102.08,40.01 v102.08,13.02
D5  (via drill 0.61)
  Top 0.254: v41.75,44.13 41.91,44.29 60.96,44.29 69.85,35.4 74.61,35.4 75.56,34.45 81.6,34.45 v88.9,27.15
  Bottom 0.254: JP1.11 90.17,7.62 IC3.19 92.39,10 92.39,20.16 88.74,23.81 88.74,26.99 v88.9,27.15 | U1.32 38.74,71.75 42.55,71.75 42.55,63.34 41.43,62.23 41.43,57.31 41.91,56.83 41.91,44.29 v41.75,44.13
D6  (via drill 0.61)
  Top 0.254: v26.19,34.92 31.59,29.53 43.66,29.53 45.72,27.46 45.72,20.8 80.17,20.8 90.17,10.79 IC3.18
  Bottom 0.254: IC3.18 87.63,7.62 JP1.13 | U1.31 27.15,71.6 19.84,71.6 19.84,46.35 23.02,43.18 23.02,40.96 26.19,37.78 v26.19,34.92
D7  (via drill 0.61)
  Top 0.254: v26.83,32.86 30.64,29.05 43.34,29.05 45.24,27.15 45.24,20.32 78.1,20.32 87.63,10.79 IC3.17
  Bottom 0.254: IC3.17 85.09,7.62 JP1.15 | U1.30 25.08,72.07 19.37,72.07 19.37,44.61 20.48,43.5 20.48,40.96 25.24,36.2 25.24,34.45 v26.83,32.86
GND  (via drill 0.6)
  other vias: 69.85,31.11
  pour Bottom: 1.27,99.06 1.27,1.27 105.41,1.27 105.41,99.06
  pour Top: 1.27,99.06 1.27,1.27 105.41,1.27 105.41,99.06
N$1
  Bottom 0.254: IC2.4 36.04,17.3 36.04,13.02 36.83,12.22 C4.-
N$2
  Bottom 0.254: IC2.2 29.53,18.73 29.53,16.99 33.97,12.54 33.97,12.22 34.29,11.91 C4.+
N$3
  Top 0.254: IC1.6 13.97,22.38 14.45,22.38 14.92,22.86 D1.A 14.92,22.7 18.89,22.7 L1.2
N$4
  Bottom 0.254: IC1.4 10,17.94 10,22.86 8.89,23.97 C1.1
N$5
  Top 0.254: IC3.13 77.47,8.1 78.26,8.1 JP1.19
N$6  (via drill 0.61)
  Top 0.254: 48.9,91.44 U1.4 | v85.25,85.09 80.49,89.85 80.49,91.76 57.94,91.76 55.25,89.06 51.28,89.06 48.9,91.44 | 48.9,91.44 U1.3
  Bottom 0.254: U1.3 U1.38 | X2.1 93.82,67.47 93.82,76.52 v85.25,85.09
N$7
  Top 0.254: C6.- 93.82,40.48 93.82,48.26 X1.1
N$8
  Top 0.254: C6.+ R1.2
N$9
  Top 0.254: R2.2 71.28,38.26 77.79,38.26 78.9,39.37 T1.3 80.17,39.21 82.71,39.21 R1.1
N$10
  Top 0.254: IC3.36 57.15,29.53 62.07,29.53 62.55,30 78.1,30 79.85,31.75 R3.2
  Bottom 0.254: T1.2 79.85,36.35 79.85,31.91 R3.2
N$11  (via drill 0.61)
  Top 0.254: v68.74,86.2 76.99,86.2 78.74,84.45 V3.9
  Bottom 0.254: v68.74,86.2 V4.2
N$12
  Top 0.254: 93.9,33.1 93.03,33.97 88.42,33.97 88.11,34.29 C7.+ 87.31,34.29 87.31,35.72 85.41,37.62 85.25,37.62 85.25,38.1 84.14,39.21 83.98,39.21 82.23,40.96 79.06,40.96 T1.1 | 93.9,33.1 C8.1 | L2.1 94.14,33.18 93.98,33.18 93.9,33.1
N$13
  Top 0.254: IC3.39 49.53,30 57.31,30 58.74,31.43 58.9,31.43 59.21,31.75 Q1.2
  Bottom 0.254: C10.1 59.53,36.67 59.53,31.75 Q1.2
N$14
  Top 0.254: IC3.40 46.99,31.43 54.13,31.43 54.45,31.75 Q1.1
  Bottom 0.254: C9.1 56.36,37.62 56.36,33.34 54.77,31.75 Q1.1
N$15
  Top 0.254: U1.29 36.99,86.52 66.83,86.52 68.58,88.27 V4.3
N$16
  Bottom 0.254: V3.14 65.72,84.14 65.72,85.88 63.5,88.11 V4.1 63.82,87.95 63.82,91.28 68.74,91.28 V4.4
N$17
  Top 0.254: U1.27 21.59,78.74 27.78,78.74 37.62,88.58 60.17,88.58 62.87,91.28 74.45,91.28 76.2,89.53 V4.6
N$18
  Bottom 0.254: V3.10 75.88,84.14 75.88,85.88 73.66,88.11 V4.5
N$19
  Top 0.254: U1.13 25.88,93.19 26.99,93.19 27.46,92.71 28.42,92.71 30.96,95.25 SV1.1
N$20
  Bottom 0.254: U1.12 29.05,89.06 35.72,89.06 35.72,92.39 38.1,94.77 SV1.2
N$21
  Bottom 0.254: U1.11 29.53,91.76 29.53,93.5 33.81,97.79 40.32,97.79 40.32,95.57 SV1.3
N$22  (via drill 0.61)
  Top 0.254: U1.10 31.75,89.06 42.55,89.06 v43.18,89.69
  Bottom 0.254: v43.18,89.69 43.02,89.85 43.02,95.09 SV1.4
N$23
  Top 0.254: U1.9 36.67,93.82 36.67,97.79 43.82,97.79 45.72,95.89 SV1.5
N$24
  Bottom 0.254: U1.8 39.53,88.74 45.88,88.74 45.88,92.39 48.26,94.77 SV1.6
N$25
  Top 0.254: U1.7 41.12,93.19 47.94,93.19 48.1,93.34 48.74,93.34 50.64,95.25 SV1.7
N$26
  Bottom 0.254: U1.6 42.07,91.6 42.07,96.52 43.34,97.79 53.02,97.79 53.02,95.57 SV1.8
N$27
  Top 0.254: U1.22 8.89,73.82 93.66,73.82 96.04,76.2 QG1.8
N$28
  Bottom 0.254: U1.21 2.06,80.49 2.06,91.6 5.08,94.61 SV2.1
N$29
  Bottom 0.254: U1.20 6.67,91.76 6.67,93.5 7.62,94.46 SV2.2
N$30
  Bottom 0.254: U1.19 9.21,91.76 9.21,93.5 10.16,94.46 SV2.3
N$31
  Bottom 0.254: U1.18 11.75,91.76 11.75,93.5 12.7,94.46 SV2.4
N$32
  Bottom 0.254: U1.17 14.29,91.76 14.29,93.5 15.24,94.46 SV2.5
N$33
  Bottom 0.254: U1.16 16.83,91.76 16.83,93.5 17.78,94.46 SV2.6
N$34
  Bottom 0.254: U1.15 19.37,91.76 19.37,93.5 20.32,94.46 SV2.7
N$35
  Bottom 0.254: U1.14 21.91,91.76 21.91,93.5 22.86,94.46 SV2.8
RD0  (via drill 0.61)
  Top 0.254: v66.04,40.48 61.44,45.09 37.94,45.09 v37.47,44.61 | v30.96,63.18 32.54,64.77 IC4.14
  Bottom 0.254: IC3.32 66.99,25.72 66.99,27.46 66.04,28.42 v66.04,40.48 | v37.47,44.61 30.96,51.12 v30.96,63.18
RD1  (via drill 0.61)
  Top 0.254: v72.39,42.39 73.34,43.34 84.14,43.34 91.12,50.32 92.39,50.32 93.82,51.75 93.82,64.45 92.71,64.45 92.39,64.77 IC5.14
  Bottom 0.254: IC3.31 72.39,27.94 v72.39,42.39
RD2  (via drill 0.61)
  Top 0.254: v77.15,48.1 v73.34,44.29
  Bottom 0.254: IC3.30 72.71,25.72 72.71,27.46 73.34,28.1 v73.34,44.29 | v77.15,48.1 77.63,48.58 77.63,63.02 79.38,64.77 IC6.14
RD3  (via drill 0.61)
  Top 0.254: v76.2,63.5 76.04,63.66 71.44,63.66 70.64,64.45 69.85,64.45 69.53,64.77 IC7.14
  Bottom 0.254: IC3.29 75.25,25.72 75.25,27.46 75.72,27.94 75.72,36.51 76.2,36.99 76.2,38.26 75.88,38.58 75.88,63.18 v76.2,63.5
RD4  (via drill 0.61)
  Top 0.254: IC3.28 77.47,29.05 v71.12,29.05
  Bottom 0.254: v71.12,29.05 71.6,29.53 71.6,41.91 69.06,44.45 69.06,48.58 65.72,51.91 65.72,64.61 61.91,68.42 60.01,68.42 58.9,67.31 58.9,66.99 57.15,65.25 IC8.14
RD5  (via drill 0.61)
  Top 0.254: v80.01,30 IC3.27 | v81.12,33.34 80.49,33.97 71.91,33.97 71.12,33.18 69.53,33.18 68.42,34.29 68.42,36.04 65.41,36.04 58.1,43.34 v50.96,43.34
  Bottom 0.254: v80.01,30 81.12,31.11 v81.12,33.34 | v50.96,43.34 43.34,50.96 43.34,63.02 45.09,64.77 IC9.14
RD6  (via drill 0.61)
  Top 0.254: v24.77,47.78 27.3,45.24 35.4,45.24 35.72,45.56 61.75,45.56 65.88,41.43 v83.03,41.43
  Bottom 0.254: IC10.14 20.48,64.77 20.48,50.01 22.54,47.94 24.77,47.94 v24.77,47.78 | v83.03,41.43 82.55,40.96 IC3.26
RD7  (via drill 0.61)
  Top 0.254: IC11.14 10.64,63.98 10.16,63.98 9.68,63.5 v8.73,63.5 | v16.19,44.29 25.72,44.29 32.38,37.62 49.69,37.62 53.82,33.5 68.26,33.5 69.21,32.54 75.88,32.54 76.83,33.5 79.69,33.5 84.77,28.42 84.77,25.4 IC3.25
  Bottom 0.254: v8.73,63.5 9.05,63.18 9.05,51.44 v16.19,44.29
VCC  (via drill 0.61)
  Top 0.254: IC5.9 90.49,52.07 90.17,51.75 89.85,51.75 C14.1 85.09,47.15 84.77,47.15 v82.71,49.21 82.71,49.05 75.72,49.05 C15.1 73.66,47.15 72.07,48.74 64.14,48.74 62.55,47.15 62.23,47.15 C16.1 60.48,48.74 57.15,48.74 | V4.14 62.23,97.79 57.63,97.79 55.88,96.04 SV1.9 | 73.66,78.58 V3.6 | 73.66,78.58 81.28,78.58 82.39,77.47 C25.1 | U1.40 55.09,76.68 58.42,76.68 60.33,78.58 73.66,78.58 | V2.6 L1.1 22.38,27.15 25.08,27.15 25.56,26.67 IC2.8 | C2.+ 35.72,21.43 25.4,21.43 24.29,20.32 C22.1 | C21.1 6.35,11.43 IC1.1 | 22.54,48.74 18.41,48.74 16.67,46.99 C26.1 16.35,46.99 14.61,48.74 6.83,48.74 C13.1 | 22.54,48.74 22.86,48.74 | 22.86,48.74 26.19,48.74 C19.1 27.94,47.15 28.26,47.15 29.84,48.74 37.62,48.74 C18.1 39.37,47.15 40.96,48.74 48.9,48.74 50.64,46.99 C17.1 50.96,46.99 52.71,48.74 57.15,48.74 | V1.16 28.89,44.77 26.51,44.77 22.54,48.74 | 22.86,48.74 v22.86,48.9 | IC3.33 64.77,29.05 v63.02,29.05 | 57.15,48.74 v57.15,48.9
  Bottom 0.254: C20.1 98.58,16.99 98.58,29.84 100.33,31.59 L2.2 100.17,31.59 93.66,38.1 93.66,48.74 91.44,50.96 IC5.9 | IC7.9 C15.1 | IC6.9 82.71,49.37 v82.71,49.21 | SV1.9 56.36,94.77 56.36,93.98 60.96,89.38 V3.16 60.96,82.87 60.64,82.55 60.64,82.23 U1.40 54.61,56.52 54.77,56.36 54.77,53.82 57.15,51.44 | 84.22,88.5 84.3,88.42 84.3,79.38 82.55,77.63 C25.1 | 84.22,88.5 C24.1 | QG1.14 93.66,88.58 84.3,88.58 84.22,88.5 | JP1.53 38.58,8.1 38.58,18.41 38.1,18.89 C2.+ | C22.1 26.67,22.86 IC2.8 26.67,27.78 27.78,28.89 27.78,35.4 C12.1 27.78,35.56 26.67,36.67 26.67,39.53 26.19,40.01 26.19,45.09 27.94,46.83 C19.1 | 18.02,82.31 17.94,82.39 3.81,82.39 C23.1 | 18.02,82.31 U1.28 23.97,76.2 23.65,75.88 23.65,75.09 21.11,72.55 18.57,72.55 18.57,52.39 14.84,48.66 | SV2.9 25.4,89.69 18.02,82.31 | C21.1 5.24,12.86 5.24,15.4 IC1.8 8.57,18.89 3.97,23.5 3.97,35.56 C11.1 6.35,38.1 V2.16 6.35,45.72 C13.1 | IC4.9 C18.1 | IC11.9 14.84,48.66 | 14.84,48.66 C26.1 | v22.86,48.9 IC10.9 | IC9.9 C17.1 | v63.02,29.05 62.39,29.69 62.39,46.83 C16.1 | v57.15,48.9 57.15,51.44 | 57.15,51.44 IC8.9